# Altium schematic sheet BatteryOperatedNode_V01.SchDoc: Battery Oprated node
size OrCAD B; Date: 3/26/2015 6:39:54 PM; ApprovedBy: Approved By:; CheckedBy: Checked By:; Author: Auther:; CompanyName: Souliss; DrawnBy: Yoosof Piran; Engineer: Yoosof Piran; Revision: None; SheetNumber: 1; Design by:: Design by:Yoosof Piran; ProjectName: Battery Operated Nodes
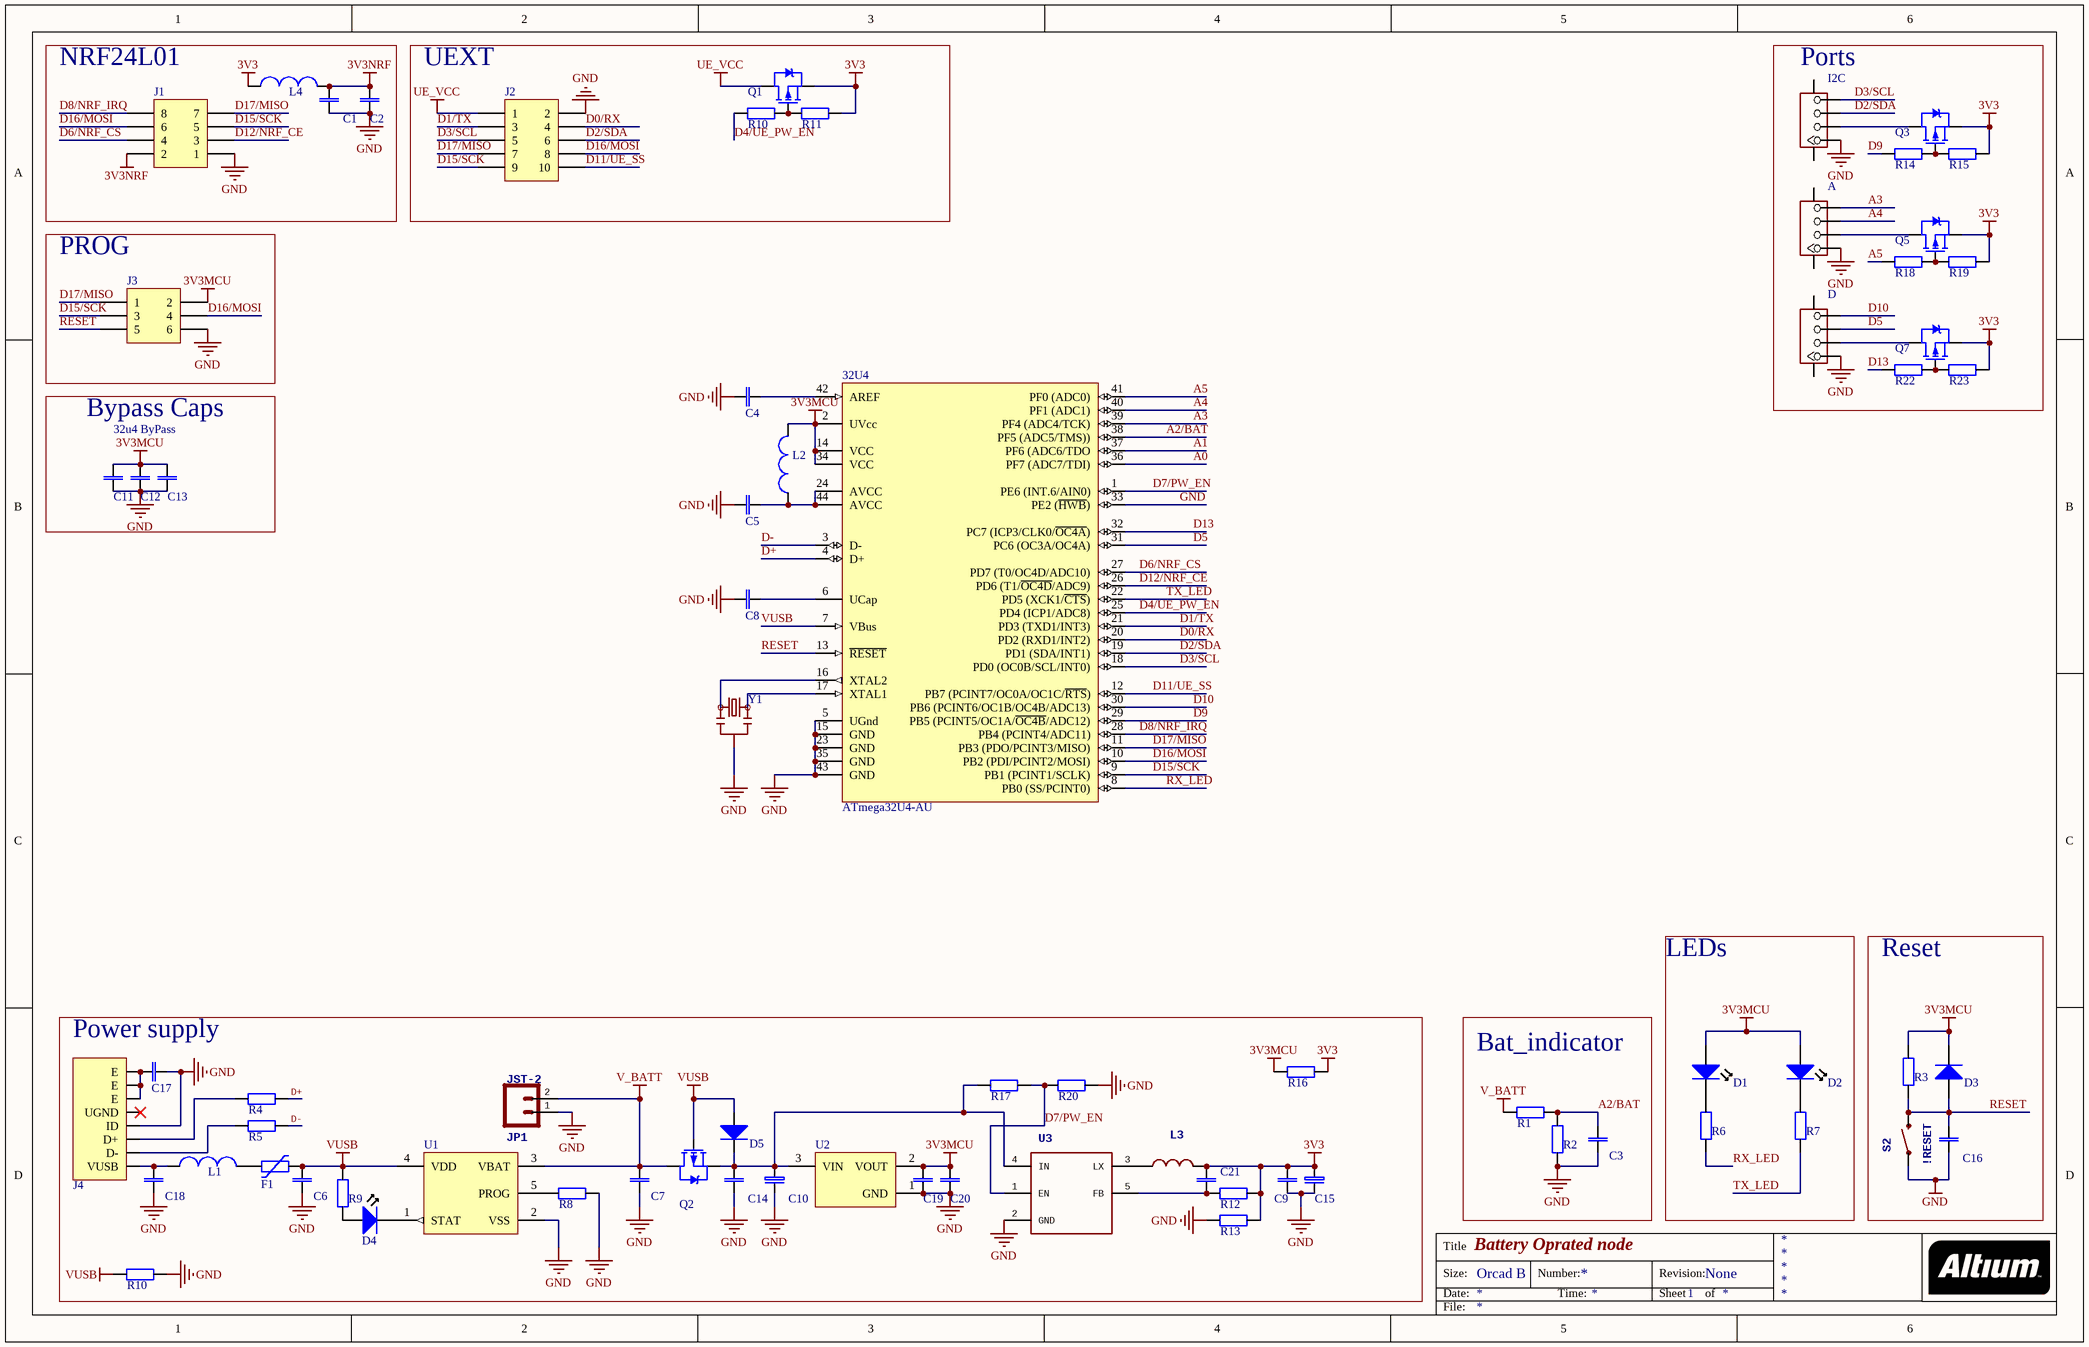
[diagram p0: BatteryOperatedNode_V01.SchDoc]

## Parts
(Parts that share a designator on the sheet are numbered #1, #2 ... from top to bottom, then left to right.)
32U4  ATmega32U4-AU  [44ML_N]
A  TWIG-4P-2.0-SMD  [4P-SMD-2.0]  (value not drawn)
C1  100nF  [C0603]  (value not drawn)
C2  10uF  [C0805]  (value not drawn)
C3  100nF  [C0603]  (value not drawn)
C4  100nF  [C0603]  (value not drawn)
C5  10nF  [C0603]  (value not drawn)
C6  4,7uF  [C0603]  (value not drawn)
C7  4,7uF  [C0603]  (value not drawn)
C8  1uF  [C0603]  (value not drawn)
C9  1uF  [C0603]  (value not drawn)
C10  TANT B SMD 100uF 6.3V  [B]  (value not drawn)
C11  100nF  [C0603]  (value not drawn)
C12  100nF  [C0603]  (value not drawn)
C13  100nF  [C0603]  (value not drawn)
C14  1uF  [C0603]  (value not drawn)
C15  TANT B SMD 100uF 6.3V  [B]  (value not drawn)
C16  10nF  [C0603]  (value not drawn)
C17  10nF  [C0603]  (value not drawn)
C18  10nF  [C0603]  (value not drawn)
C19  4,7uF  [C0603]  (value not drawn)
C20  4,7uF  [C0603]  (value not drawn)
C21  22pF  [C0603]  (value not drawn)
D  TWIG-4P-2.0-SMD  [4P-SMD-2.0]  (value not drawn)
D1  GREEN LED  [LED0805G]  (value not drawn)
D2  ORANGE LED  [LED0805OR]  (value not drawn)
D3  1N4148WS  [SOD323]  (value not drawn)
D4  RED LED  [LED0805R]  (value not drawn)
D5  B340A  [DO-214AC(SMA)]  (value not drawn)
F1  PFMF.XXX.X  [F1812]  (value not drawn)
I2C  TWIG-4P-2.0-SMD  [4P-SMD-2.0]  (value not drawn)
J1  Header 4X2  [HDR2X4]  (value not drawn)
J2  Header 5X2  [HDR2X5]  (value not drawn)
J3  Header 3X2  [HDR2X3]  (value not drawn)
J4  USB B MICRO R/A SMD 1  [USB B MICRO R/A SMD 1]  (value not drawn)
JP1  JST-2  [JST-2-SMD]
L1  BLM18PG121SN1D  [L0603]  (value not drawn)
L2  BLM18AG601SN1D  [L0603]  (value not drawn)
L3  SRN4026-2R2Y  [CD32]  (value not drawn)
L4  BLM18PG121SN1D  [L0603]  (value not drawn)
Q1  IRLML6401  [SOT23]  (value not drawn)
Q2  IRLML6401  [SOT23]  (value not drawn)
Q3  IRLML6401  [SOT23]  (value not drawn)
Q5  IRLML6401  [SOT23]  (value not drawn)
Q7  IRLML6401  [SOT23]  (value not drawn)
R1  1M  [R0603]  (value not drawn)
R2  470K  [R0603]  (value not drawn)
R3  10K  [R0603]  (value not drawn)
R4  22  [R0603]  (value not drawn)
R5  22  [R0603]  (value not drawn)
R6  330  [R0603]  (value not drawn)
R7  330  [R0603]  (value not drawn)
R8  10K  [R0603]  (value not drawn)
R9  330  [R0603]  (value not drawn)
R10#1  10K  [R0603]  (value not drawn)
R10#2  not mounted  [R0603]  (value not drawn)
R11  100K  [R0603]  (value not drawn)
R12  4.99K  [R0603]  (value not drawn)
R13  1.1K  [R0603]  (value not drawn)
R14  10K  [R0603]  (value not drawn)
R15  100K  [R0603]  (value not drawn)
R16  not mounted  [R0603]  (value not drawn)
R17  not mounted  [R0603]  (value not drawn)
R18  10K  [R0603]  (value not drawn)
R19  100K  [R0603]  (value not drawn)
R20  10K  [R0603]  (value not drawn)
R22  10K  [R0603]  (value not drawn)
R23  100K  [R0603]  (value not drawn)
S2  !RESET  [TACTILE_SWITCH_SMD]
U1  MCP73831T-2ACI/OT  [SOT-23-OT5_N]  (value not drawn)
U2  MCP1701AT-3302I/CB  [SOT-23A-CB3_N]  (value not drawn)
U3  SY8009AAAC(SOT23-5)  [SOT23-5]  (value not drawn)
Y1  16MHZ  [RESONATOR-SMD]  (value not drawn)

## Blocks framed on the sheet
NRF24L01: C1 C2 J1 L4
UEXT: J2 Q1 R10#1 R11
Ports: A D I2C Q3 Q5 Q7 R14 R15 R18 R19 R22 R23
PROG: J3
Bypass Caps: C11-C13
LEDs: D1 D2 R6 R7
Reset: C16 D3 R3 S2
Power supply: C6 C7 C9 C10 C14 C15 C17-C21 D4 D5 F1 J4 JP1 L1 L3 Q2 R4 R5 R8 R9 R10#2 R12 R13 R16 R17 R20 U1-U3
Bat_indicator: C3 R1 R2

## Nets
3V3: C9.2 C15.1 C21.2 L3.2 L4.1 Q1.2 Q3.2 Q5.2 Q7.2 R11.2 R12.1 R13.1 R15.2 R16.1 R19.2 R23.2
3V3MCU: 32U4.2(UVcc) 32U4.14(VCC) 32U4.34(VCC) C11.2 C12.2 C13.2 C19.2 C20.2 D1.2 D2.2 D3.1 J3.2 L2.2 R3.2 R16.2 U2.2(VOUT)
3V3NRF: C1.2 C2.2 J1.2 L4.2
GND: 32U4.5(UGnd) 32U4.15(GND) 32U4.23(GND) 32U4.33(PE2_(~{HWB})) 32U4.35(GND) 32U4.43(GND) A.1 C1.1 C2.1 C3.1 C4.2 C5.2 C6.1 C7.1 C8.2 C9.1 C10.2 C11.1 C12.1 C13.1 C14.1 C15.2 C16.1 C17.2 C18.1 C19.1 C20.1 D.1 I2C.1 J1.1 J2.2 J3.6 J4.4(ID) JP1.1 R2.1 R8.1 R10#2.1 R13.2 R20.2 S2.1 U1.2(VSS) U2.1(GND) U3.2(GND) Y1.2
UE_VCC: J2.1 Q1.3
V_BATT: C7.2 JP1.2 Q2.3 R1.2 U1.3(VBAT)
VUSB: 32U4.7(VBus) C6.2 D5.2 F1.2 Q2.1 R9.2 R10#2.2 U1.4(VDD)
A0: 32U4.36(PF7_(ADC7/TDI))
A1: 32U4.37(PF6_(ADC6/TDO)
A2/BAT: 32U4.38(PF5_(ADC5/TMS))) C3.2 R1.1 R2.2
A3: 32U4.39(PF4_(ADC4/TCK)) A.4
A4: 32U4.40(PF1_(ADC1)) A.3
A5: 32U4.41(PF0_(ADC0)) R18.2
D0/RX: 32U4.20(PD2_(RXD1/INT2)) J2.4
D1/TX: 32U4.21(PD3_(TXD1/INT3)) J2.3
D2/SDA: 32U4.19(PD1_(SDA/INT1)) I2C.3 J2.6
D3/SCL: 32U4.18(PD0_(OC0B/SCL/INT0)) I2C.4 J2.5
D4/UE_PW_EN: 32U4.25(PD4_(ICP1/ADC8)) R10#1.2
D5: 32U4.31(PC6_(OC3A/OC4A)) D.3
D6/NRF_CS: 32U4.27(PD7_(T0/OC4D/ADC10)) J1.4
D7/PW_EN: 32U4.1(PE6_(INT.6/AIN0)) R17.1 R20.1 U3.1(EN)
D8/NRF_IRQ: 32U4.28(PB4_(PCINT4/ADC11)) J1.8
D9: 32U4.29(PB5_(PCINT5/OC1A/~{OC4B}/ADC12)) R14.2
D10: 32U4.30(PB6_(PCINT6/OC1B/OC4B/ADC13)) D.4
D11/UE_SS: 32U4.12(PB7_(PCINT7/OC0A/OC1C/~{RTS})) J2.10
D12/NRF_CE: 32U4.26(PD6_(T1/~{OC4D}/ADC9)) J1.3
D13: 32U4.32(PC7_(ICP3/CLK0/~{OC4A})) R22.2
D15/SCK: 32U4.9(PB1_(PCINT1/SCLK)) J1.5 J2.9 J3.3
D16/MOSI: 32U4.10(PB2_(PDI/PCINT2/MOSI)) J1.6 J2.8 J3.4
D17/MISO: 32U4.11(PB3_(PDO/PCINT3/MISO)) J1.7 J2.7 J3.1
D+: 32U4.4(D+) R4.2
D-: 32U4.3(D-) R5.2
RESET: 32U4.13(~{RESET}) C16.2 D3.2 J3.5 R3.1 S2.3
RX_LED: 32U4.8(PB0_(SS/PCINT0)) R6.1
TX_LED: 32U4.22(PD5_(XCK1/~{CTS})) R7.1
Net32U4_6: 32U4.6(UCap) C8.1
Net32U4_16: 32U4.16(XTAL2) Y1.1
Net32U4_17: 32U4.17(XTAL1) Y1.3
Net32U4_24: 32U4.24(AVCC) 32U4.44(AVCC) C5.1 L2.1
Net32U4_42: 32U4.42(AREF) C4.1
NetA_2: A.2 Q5.3
NetC10_1: C10.1 C14.2 D5.1 Q2.2 R17.2 U2.3(VIN) U3.4(IN)
NetC17_1: C17.1 J4.6(E) J4.7(E) J4.8(E)
NetC18_2: C18.2 J4.1(VUSB) L1.1
NetC21_1: C21.1 R12.2 U3.5(FB)
NetD1_1: D1.1 R6.2
NetD2_1: D2.1 R7.2
NetD4_1: D4.1 U1.1(STAT)
NetD4_2: D4.2 R9.1
NetD_2: D.2 Q7.3
NetF1_1: F1.1 L1.2
NetI2C_2: I2C.2 Q3.3
NetJ4_2: J4.2(D-) R5.1
NetJ4_3: J4.3(D+) R4.1
NetL3_1: L3.1 U3.3(LX)
NetQ1_1: Q1.1 R10#1.1 R11.1
NetQ3_1: Q3.1 R14.1 R15.1
NetQ5_1: Q5.1 R18.1 R19.1
NetQ7_1: Q7.1 R22.1 R23.1
NetR8_2: R8.2 U1.5(PROG)

Not connected (* = marked no-connect by the designer): A SS1 SS2; D SS1 SS2; I2C SS1 SS2; J4 5(UGND)*

## Notes on the sheet
- 32u4 ByPass
- Title
- Size:
- Date:
- Orcad B
- Number:
- Time:
- Revision:
- Sheet
- of
- File:

## Library data of the parts
32U4 = ATmega32U4-AU: 8-bit AVR Microcontroller, 44-pin TQFP, Industrial Grade (-40°C to 85°C); Published: 1-Apr-2010; DatasheetVersion: revD, Jan-2009; PackageVersion: rev.G, Jul-2007; PackageReference: 44ML; Publisher: Altium Limited; PackageDescription: 44-Pin Plastic Thin Quad Flat Pack, 10 x 10 x 1.0 mm Body, 0.8 mm Pitch (TQFP); Supplier 1: Digi-Key; Supplier Part Number 1: ATMEGA32U4-AU-ND; Supplier 2: Farnell; Supplier Part Number 2: 1748525; Supplier 3: Mouser; Supplier Part Number 3: 556-ATMEGA32U4-AU; ComponentLink1Description: Manufacturer Link; ComponentLink1URL: http://www.atmel.com/products/avr/default.asp?; ComponentLink2Description: ATmega16U4/32U4 Datasheet; ComponentLink2URL: http://www.atmel.com/dyn/resources/prod_documents/doc7766.pdf; ComponentLink3Description: ATmega16U4 ATmega32U4 Summary; ComponentLink3URL: http://www.atmel.com/dyn/resources/prod_documents/7766S.pdf; ComponentLink4Description: Atmel.com Home; ComponentLink4URL: http://www.atmel.com
A D I2C = TWIG-4P-2.0-SMD-FEMALE-REINFORCE'DD': part num:1125S-SMT-4P URL: http://oom.lt/J204S
C1 C3-C9 C11-C14 C16-C21 = C0603: SMD Capacitor
C2 = C0805: SMD Capacitor
C10 C15 = CAP_SMT_F6.3: Electrolytic Capacitor D6,3
D1 = LED0805G: GREEN SMD LED 0805
D2 = LED0805OR: ORANGE SMD LED 0805
D3 = 1N4148WS: Fast Switching  Surface Mount  SOD323
D4 = LED0805R: RED SMD LED 0805
D5 = GF1A: General Purpose Rectifiers (Glass Passivated)
F1 = PFMF.XXX.X: Resettable Fuse 1812
J1 = Header 4X2: Header, 4-Pin, Dual row; Revision: 17-Jul-2002: Re-released for DXP Platform.; Publisher: Altium Limited
J2 = Header 5X2: Header, 5-Pin, Dual row; Revision: 17-Jul-2002: Re-released for DXP Platform.; Publisher: Altium Limited
J3 = Header 3X2: Header, 3-Pin, Dual row; Revision: 17-Jul-2002: Re-released for DXP Platform.; Publisher: Altium Limited
JP1 = M02-JST-2MM-SMT: Standard 2-pin 0.1" header. Use with <br> / - straight break away headers ( PRT-00116)<br> / - right angle break away headers (PRT-00553)<br> / - swiss pins (PRT-00743)<br> / - machine pins (PRT-00117)<br> / - female headers (PRT-00115)<br><br> / Molex polarized connector foot print use with: PRT-08233 with associated crimp pins and housings.<br><br> / 2.54_SCREWTERM for use with  PRT-10571.<br><br> / 3.5mm Screw Terminal footprints for  PRT-08084<br><br> / 5mm Screw Terminal footprints for use with PRT-08433; PROD_ID: CONN-08352
L1 L2 L4 = L0603: EMI Filter Beads
L3 = L-CD32
Q1-Q3 Q5 Q7 = FDN5618P: 60V P-Channel Logic Level PowerTrench MOSFET
R1-R9 R10#1 R10#2 R11-R20 R22 R23 = R0603: SMD Resistor
S2 = SWITCH-MOMENTARY-2SMD: Various NO switches- part num:TS-1518S
U1 = MCP73831T-2ACI/OT: Miniature Single-Cell, Fully Integrated Li-Ion, Li-Polymer Charge Management Controller, 4.2V, 5-Pin SOT-23, Industrial Temperature, Tape and Reel; Manufacturer: Microchip; DatasheetVersion: revE, Sep-2008; PackageVersion: revBB, Aug-2009; PackageReference: SOT-23-OT5; PackageDescription: 5-Lead Plastic Small Outline Transistor (OT) [SOT-23]; Supplier 1: Digi-Key; Supplier Part Number 1: MCP73831T-2ACI/OTTR-ND; Supplier 2: Digi-Key; Supplier Part Number 2: MCP73831T-2ACI/OTCT-ND; Supplier 3: Digi-Key; Supplier Part Number 3: MCP73831T-2ACI/OTDKR-ND; Supplier 4: Farnell; Supplier Part Number 4: 1332158; Supplier 5: Farnell; Supplier Part Number 5: 1332158RL; Supplier 6: Newark; Supplier Part Number 6: 56K7045; Supplier 7: Mouser; Supplier Part Number 7: 579-MCP73831T-2ACIOT; Mounting Technology: Surface Mount; Code_IPC: SOT23-5; PartNumber: MCP73831T-2ACI/OT; ComponentLink1Description: Manufacturer URL; ComponentLink1URL: http://www.microchip.com/; ComponentLink2Description: Datasheet; ComponentLink2URL: http://ww1.microchip.com/downloads/en/DeviceDoc/21984e.pdf; ComponentLink3Description: Package Specification; ComponentLink3URL: http://www.microchip.com/stellent/groups/techpub_sg/documents/packagingspec/en012702.pdf
U2 = MCP1701AT-3302I/CB: 2 µA Low-Dropout Positive Voltage Regulator, 3-Pin SOT-23A, Industrial Temperature, Tape and Reel; DatasheetVersion: revC, Feb-2007; PackageVersion: revBB, Aug-2009; PackageReference: SOT-23A-CB3; PackageDescription: 3-Lead Plastic Small Outline Transistor (CB) [SOT-23A]; ComponentLink1Description: Manufacturer URL; ComponentLink1URL: http://www.microchip.com/; ComponentLink2Description: Datasheet; ComponentLink2URL: http://ww1.microchip.com/downloads/en/DeviceDoc/21991c.pdf; ComponentLink3Description: Package Specification; ComponentLink3URL: http://www.microchip.com/stellent/groups/techpub_sg/documents/packagingspec/en012702.pdf
U3 = SY8008
Y1 = RESONATOR8MHZ: Resonator ,Small SMD resonator,Used, eg, on the Arduino Pro/ Pro Mini boards.  16MHz- XTAL-08895; PROD_ID: XTAL-08895